# Altium schematic sheet Fuse_2.schdoc
size 127 x 99 mm
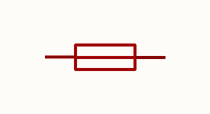
[diagram p0: Fuse_2.schdoc]

## Parts
F?  C05228-000  [F1206]  (value not drawn)

## Nets

Not connected (* = marked no-connect by the designer): F? 1 2

## Library data of the parts
F? = C05228-000: Manufacturer: Littelfuse(美国力特); Add into BOM: yes; Type: SMD Fuse; Current Rating: 5A; Voltage Rating (DC): 32V; Breaking Capacity: 45A; Symbol: C05228-000; Device: C05228-000; LCSC Part Name: 贴片式保险丝; Supplier Part: C207129; Manufacturer Part: C05228-000; Supplier Footprint: 1206; JLCPCB Part Class: Extended Part; Datasheet: https://atta.szlcsc.com/upload/public/pdf/source/20191009/C434710_3F89FEC5E8B25E469DD927D36E88D4C3.pdf; Supplier: LCSC; Convert to PCB: yes; Operating Temperature: -55℃~+125℃